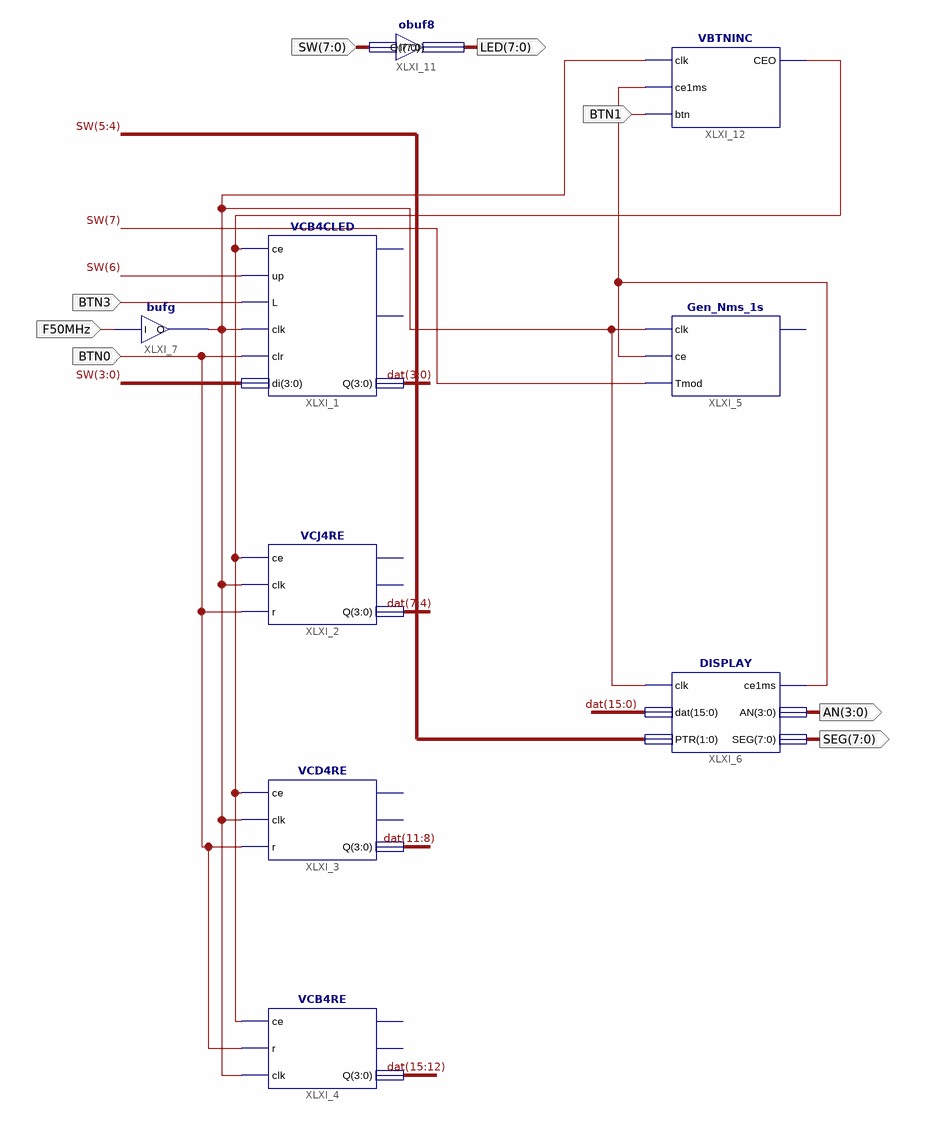
[diagram p0: schematic sheet 1]
// Xilinx ISE schematic Sch1.sch (spartan3e) as structural Verilog: 9 symbols, 8 ports
module Sch1 (
  input  BTN0,
  input  BTN3,
  input  F50MHz,
  input  [7:0] SW,
  input  BTN1,
  output [3:0] AN,
  output [7:0] SEG,
  output [7:0] LED
);

  wire XLXN_13, XLXN_23, XLXN_24;
  wire [15:0] dat;

  VCB4CLED XLXI_1 (
    .ce(XLXN_23), .up(SW[6]), .L(BTN3), .clk(XLXN_13), .clr(BTN0), .di(SW[3:0]), .Q(dat[3:0]));  // open: CEO, TC
  VCJ4RE XLXI_2 (.ce(XLXN_23), .clk(XLXN_13), .r(BTN0), .Q(dat[7:4]));  // open: TC, CEO
  VCD4RE XLXI_3 (.ce(XLXN_23), .clk(XLXN_13), .r(BTN0), .Q(dat[11:8]));  // open: TC, CEO
  VCB4RE XLXI_4 (.ce(XLXN_23), .r(BTN0), .clk(XLXN_13), .Q(dat[15:12]));  // open: TC, CEO
  Gen_Nms_1s XLXI_5 (.clk(XLXN_13), .ce(XLXN_24), .Tmod(SW[7]));  // open: CEO
  DISPLAY XLXI_6 (.clk(XLXN_13), .dat(dat), .PTR(SW[5:4]), .ce1ms(XLXN_24), .AN(AN), .SEG(SEG));
  bufg XLXI_7 (.I(F50MHz), .O(XLXN_13));
  obuf8 XLXI_11 (.I(SW), .O(LED));
  VBTNINC XLXI_12 (.clk(XLXN_13), .ce1ms(XLXN_24), .btn(BTN1), .CEO(XLXN_23));
endmodule
